# EAGLE design TrSensorModule (EAGLE 5.11)
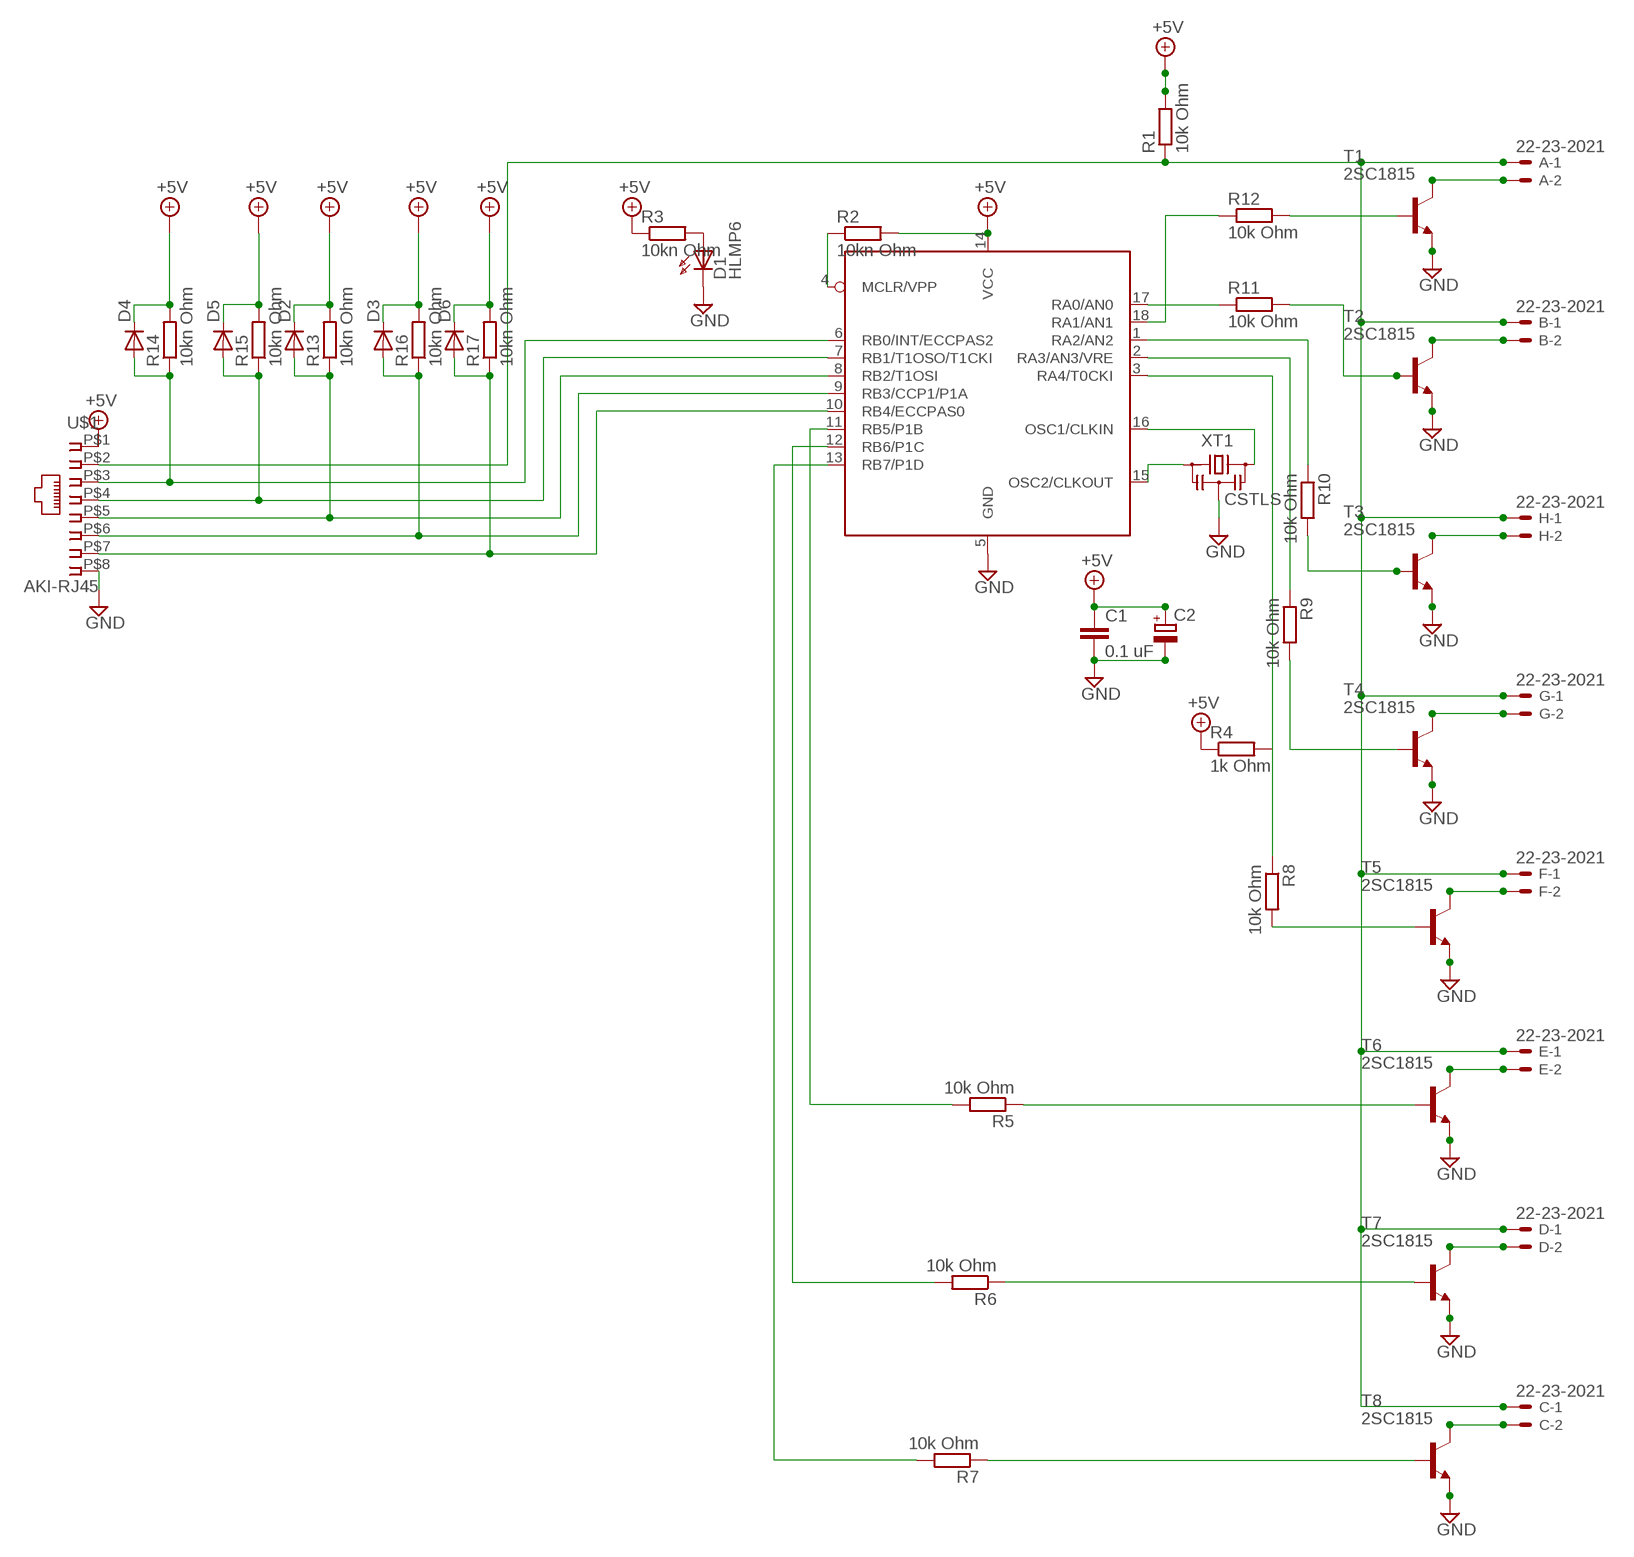
[diagram p0: schematic, sheet 1]

## Parts
A  22-23-2021  [22-23-2021]
B  22-23-2021  [22-23-2021]
C  22-23-2021  [22-23-2021]
C1  0.1 uF  C2.5/2  [C2.5-2]
C2  CPOL-EUE2.5-6  [E2,5-6]
D  22-23-2021  [22-23-2021]
D1  HLMP6  [HLMP6]
D2  DIODE-D-2.5  [D-2.5]
D3  DIODE-D-2.5  [D-2.5]
D4  DIODE-D-2.5  [D-2.5]
D5  DIODE-D-2.5  [D-2.5]
D6  DIODE-D-2.5  [D-2.5]
E  22-23-2021  [22-23-2021]
F  22-23-2021  [22-23-2021]
G  22-23-2021  [22-23-2021]
H  22-23-2021  [22-23-2021]
IC1  PIC16F716-P  [DIL18]
R1  10k Ohm  R-EU_0204/2V  [0204V]
R2  10kn Ohm  R-EU_0204/2V  [0204V]
R3  10kn Ohm  R-EU_0204/7  [0204/7]
R4  1k Ohm  R-EU_0207/2V  [0207/2V]
R5  10k Ohm  R-EU_0204/2V  [0204V]
R6  10k Ohm  R-EU_0204/2V  [0204V]
R7  10k Ohm  R-EU_0204/2V  [0204V]
R8  10k Ohm  R-EU_0204/2V  [0204V]
R9  10k Ohm  R-EU_0204/2V  [0204V]
R10  10k Ohm  R-EU_0204/2V  [0204V]
R11  10k Ohm  R-EU_0204/2V  [0204V]
R12  10k Ohm  R-EU_0204/2V  [0204V]
R13  10kn Ohm  R-EU_0204/2V  [0204V]
R14  10kn Ohm  R-EU_0204/2V  [0204V]
R15  10kn Ohm  R-EU_0204/2V  [0204V]
R16  10kn Ohm  R-EU_0204/2V  [0204V]
R17  10kn Ohm  R-EU_0204/2V  [0204V]
T1  2SC1815  [TO92-ECB]
T2  2SC1815  [TO92-ECB]
T3  2SC1815  [TO92-ECB]
T4  2SC1815  [TO92-ECB]
T5  2SC1815  [TO92-ECB]
T6  2SC1815  [TO92-ECB]
T7  2SC1815  [TO92-ECB]
T8  2SC1815  [TO92-ECB]
U$1  AKI-RJ45  [C-00159]
XT1  CSTLS  [S3P]

## Nets
+5V: C1.1 C2.+ D2.C D3.C D4.C D5.C D6.C IC1.14(VCC) R1.2 R2.2 R3.1 R4.1 R13.2 R14.2 R15.2 R16.2 R17.2 U$1.P$1
GND: C1.2 C2.- D1.K IC1.5(GND) T1.E T2.E T3.E T4.E T5.E T6.E T7.E T8.E U$1.P$8 XT1.P$2
N$1: D4.A IC1.6(RB0/INT/ECCPAS2) R14.1 U$1.P$3
N$2: D5.A IC1.7(RB1/T1OSO/T1CKI) R15.1 U$1.P$4
N$3: D2.A IC1.8(RB2/T1OSI) R13.1 U$1.P$5
N$4: D3.A IC1.9(RB3/CCP1/P1A) R16.1 U$1.P$6
N$5: IC1.15(OSC2/CLKOUT) XT1.P$1
N$6: A.1 B.1 C.1 D.1 E.1 F.1 G.1 H.1 R1.1 U$1.P$2
N$7: A.2 T1.C
N$8: R11.2 T2.B
N$9: IC1.16(OSC1/CLKIN) XT1.P$3
N$10: IC1.1(RA2/AN2) R10.1
N$11: H.2 T3.C
N$12: B.2 T2.C
N$13: IC1.2(RA3/AN3/VRE) R9.1
N$14: G.2 T4.C
N$15: E.2 T6.C
N$16: F.2 T5.C
N$17: IC1.3(RA4/T0CKI) R4.2 R8.1
N$18: IC1.11(RB5/P1B) R5.2
N$19: C.2 T8.C
N$20: D.2 T7.C
N$21: IC1.12(RB6/P1C) R6.2
N$22: IC1.13(RB7/P1D) R7.2
N$23: IC1.4(MCLR/VPP) R2.1
N$24: D6.A IC1.10(RB4/ECCPAS0) R17.1 U$1.P$7
N$25: IC1.18(RA1/AN1) R12.1
N$26: D1.A R3.2
N$27: R5.1 T6.B
N$28: R6.1 T7.B
N$29: R7.1 T8.B
N$30: R8.2 T5.B
N$31: R9.2 T4.B
N$32: R10.2 T3.B
N$33: IC1.17(RA0/AN0) R11.1
N$34: R12.2 T1.B

## Library data of the parts
A B C D E F G H = con-molex:22-23-2021: .100" (2.54mm) Center Header - 2 Pin; MF: MOLEX; MPN: 22-23-2021; OC_FARNELL: 1462926; OC_NEWARK: 25C3832
C1 = capacitor-wima:C: CAPACITOR naming: grid - package width
C2 = rcl:CPOL-EU: POLARIZED CAPACITOR, European symbol
D1 = display-hp:HLMP6: LED 2mm horizontal; MF: AGILENT TECHNOLOGIES; MPN: HLMP-6500; OC_FARNELL: 1652490; OC_NEWARK: 40K0088
D2-D6 = diode:DIODE-: DIODE
IC1 = microchip_pic16f716:PIC16F716-P: PIC16F716 in DIL18 package
R1-R3 R5-R17 = rcl:R-EU_: RESISTOR, European symbol
R4 = resistor:R-EU_: RESISTOR, European symbol
T1-T8 = myparts:2SC1815: NPN EPITAXIAL TRANSISTOR Source: TOSHIBA .. 2SC1815 1.pdf
U$1 = myparts:AKI-RJ45
XT1 = TOG:CSTLS: Resonator, Murata Ceralock

## Board
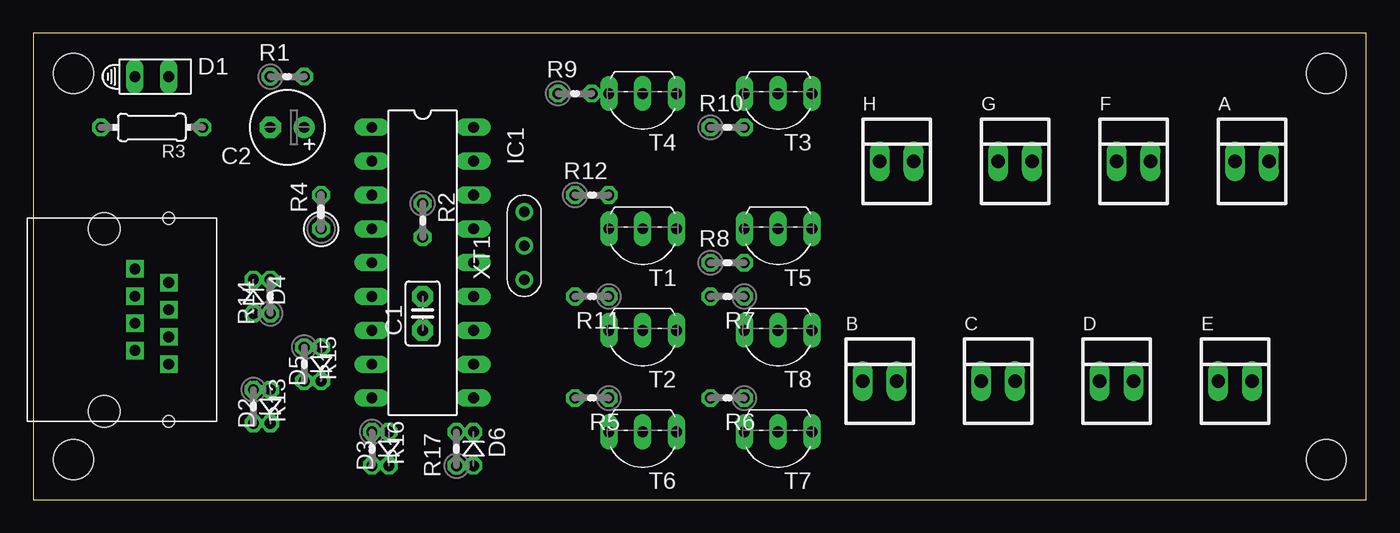
[diagram p1: board, top side]
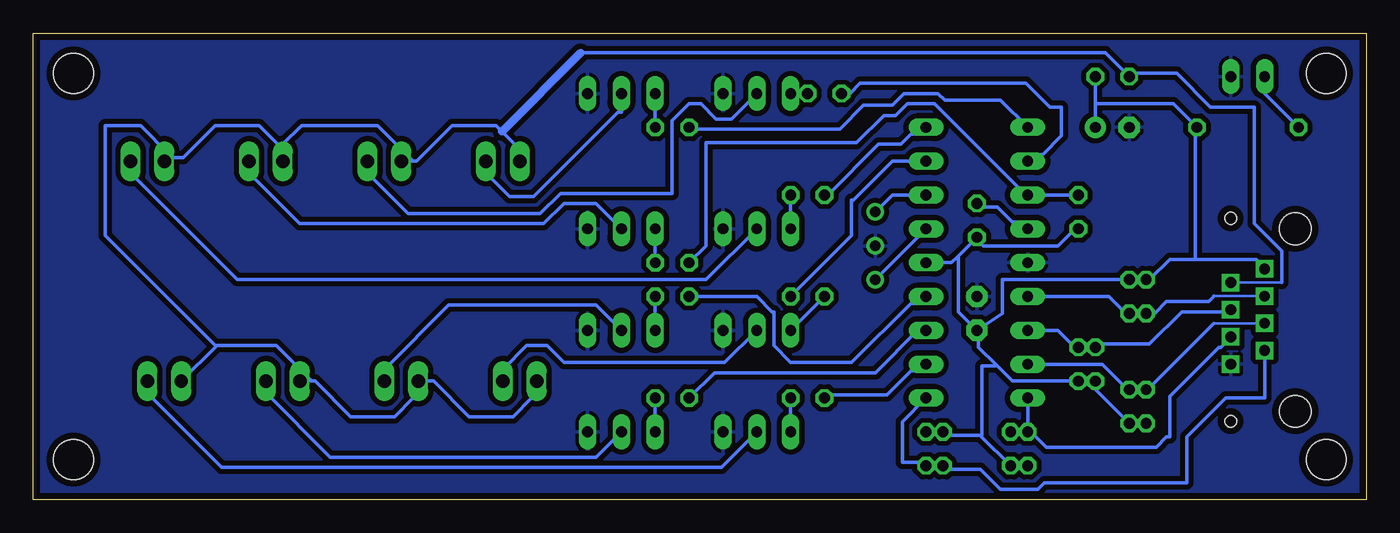
[diagram p2: board, bottom side, seen from below]

Size 100 x 35 mm. Coordinates in mm from the lower left corner, seen from the top.
Outline: 0,0 100,0 100,35 0,35 0,0
Copper layers (1*16): Top 0.035mm / dielectric 1.5mm / Bottom 0.035mm
Design rules "default *": minimum track width 10mil, minimum drill 15mil, track to track 15mil, track to pad 17mil, pad to pad 20mil, via to via 16mil, smd to smd 16mil, copper to edge 20mil, drill to drill 16mil, minimum pad ring 10mil, minimum via ring 8mil, stop-mask expansion 4mil, vias tented up to drill 0mil, thermal gap 10mil
Holes 3 mm at 3,3 3,32 97,32 97,3

### Footprints (pad centres in the part's own frame; a part is rotated, then mirrored left to right if it is on the bottom)
22-23-2021 = drill 1 long: 1 -1.27,0; 2 1.27,0
C2.5-2 = drill 0.813 pad 1.6 octagon: 1 -1.27,0; 2 1.27,0
E2,5-6 = drill 0.813 pad 1.6 round: + -1.27,0 | drill 0.813 pad 1.6 octagon: - 1.27,0
HLMP6 = drill 0.813 long: A -1.27,0; K 1.27,0
D-2.5 = drill 0.813 octagon: A 1.27,0; C -1.27,0
DIL18 = drill 0.813 long: 1 0,0; 2 2.54,0; 3 5.08,0; 4 7.62,0; 5 10.16,0; 6 12.7,0; 7 15.24,0; 8 17.78,0; 9 20.32,0; 10 20.32,7.62; 11 17.78,7.62; 12 15.24,7.62; 13 12.7,7.62; 14 10.16,7.62; 15 7.62,7.62; 16 5.08,7.62; 17 2.54,7.62; 18 0,7.62
0204V = drill 0.813 octagon: 1 -1.27,0; 2 1.27,0
0204/7 = drill 0.813 octagon: 1 -3.81,0; 2 3.81,0
0207/2V = drill 0.813 octagon: 1 -1.27,0; 2 1.27,0
TO92-ECB = drill 0.813 long: B 2.54,0; C 0,0; E -2.54,0
C-00159 = drill 0.8 square: P$1 0,0.8; P$2 2.54,-0.22; P$3 0,-1.24; P$4 2.54,-2.26; P$5 0,-3.28; P$6 2.54,-4.3; P$7 0,-5.32; P$8 2.54,-6.34 | hole 2.4: -2.3,-9.885; -2.3,3.805 | hole 0.9: 2.54,4.605; 2.54,-10.635
S3P = drill 0.8 round: P$1 -2.54,0; P$2 0,0; P$3 2.54,0

### Placement (x,y rotation side)
A  91.44,25.4 0 top
B  63.5,8.89 0 top
C  72.39,8.89 0 top
C1  29.21,13.97 90 top
C2  19.05,27.94 180 top
D  81.28,8.89 0 top
D1  8.89,31.75 0 top
D2  17.78,6.99 90 top
D3  26.67,3.81 90 top
D4  16.51,15.24 270 top
D5  21.59,10.16 90 top
D6  33.02,3.81 270 top
E  90.17,8.89 0 top
F  82.55,25.4 0 top
G  73.66,25.4 0 top
H  64.77,25.4 0 top
IC1  25.4,27.94 270 top
R1  19.05,31.75 0 top
R2  29.21,20.95 270 top
R3  8.89,27.94 180 top
R4  21.59,21.59 90 top
R5  41.91,7.62 180 top
R6  52.07,7.62 180 top
R7  52.07,15.24 180 top
R8  52.07,17.78 0 top
R9  40.64,30.48 0 top
R10  52.07,27.94 0 top
R11  41.91,15.24 180 top
R12  41.91,22.86 0 top
R13  16.51,6.99 270 top
R14  17.78,15.24 90 top
R15  20.32,10.16 270 top
R16  25.4,3.81 270 top
R17  31.75,3.81 90 top
T1  45.72,20.32 180 top
T2  45.72,12.7 180 top
T3  55.88,30.48 180 top
T4  45.72,30.48 180 top
T5  55.88,20.32 180 top
T6  45.72,5.08 180 top
T7  55.88,5.08 180 top
T8  55.88,12.7 180 top
U$1  7.62,16.51 0 top
XT1  36.83,19.05 90 top

### Tracks (layer width: path | path; a pad name or v marks a point on that pad's centre or on a via)
+5V
  Bottom 0.254: 30.67,18.22 31.11,17.78 IC1.14 | 30.67,18.22 R2.2 29.21,19.56 28.7,19.05 23.11,19.05 22.1,20.07 21.84,20.07 R4.1 21.59,20.19 21.46,20.19 | C1.1 30.61,14.1 30.61,18.16 30.67,18.22 | 20.95,8.89 R15.2 | R13.2 D2.C 20.95,8.89 | 28.89,4.76 28.96,4.83 31.11,4.83 31.37,5.08 R17.2 D6.C | 27.75,10.1 29.08,11.43 29.08,12.7 C1.1 | 27.75,10.1 26.54,8.89 D5.C 20.95,8.89 | 28.89,4.76 28.83,4.83 28.83,10.03 27.81,10.03 27.75,10.1 | R16.2 D3.C 28.89,4.76 | 20.32,29.72 C2.+ | 20.32,29.72 R1.2 | C1.1 27.3,13.97 27.3,16.51 R14.2 D4.C 16.26,16.51 14.73,18.03 12.83,18.03 | 12.83,18.03 8.26,18.03 7.62,17.4 U$1.P$1 | 20.32,29.72 14.48,29.72 R3.1 12.83,27.94 12.83,18.03
GND
  pour Bottom: 0,35.56 0,0 101.6,0 101.6,35.56
N$1
  Bottom 0.2: U$1.P$3 11.43,15.27
  Bottom 0.254: IC1.6 19.3,15.24 18.03,13.97 R14.1 D4.A 15.88,13.97 14.99,14.86 11.81,14.86 11.43,15.24 11.43,15.27
N$2
  Bottom 0.254: IC1.7 23.11,12.7 21.84,11.43 D5.A R15.1 19.94,11.43 19.68,11.68 16.26,11.68 13.84,14.1 10.29,14.1 10.16,14.22 U$1.P$4
N$3
  Bottom 0.2: U$1.P$5 11.43,13.23
  Bottom 0.254: IC1.8 19.81,10.16 17.91,8.26 D2.A R13.1 16.38,8.26 11.43,13.21 11.43,13.23
N$4
  Bottom 0.254: R16.1 D3.A | R16.1 IC1.9 | R16.1 25.15,5.08 24,3.94 15.75,3.94 14.99,4.7 14.73,4.7 14.73,7.75 11.05,11.43 10.92,11.43 10.16,12.19 U$1.P$6
N$5
  Bottom 0.254: XT1.P$1 IC1.15
N$6
  Bottom 0.2: 6.35,16.29 U$1.P$2
  Bottom 0.254: B.1 62.23,7.62 62.61,7.62 64.01,6.22 67.31,6.22 69.98,8.89 C.1 71.12,7.62 71.5,7.62 72.9,6.22 76.2,6.22 78.87,8.89 79.12,8.89 | 79.12,8.89 D.1 | 86.3,11.49 86.23,11.56 81.79,11.56 79.12,8.89 | 86.3,11.49 E.1 | 86.3,11.49 94.61,19.81 94.61,28.07 91.95,28.07 89.79,25.91 A.1 89.92,25.65 88.77,25.65 86.36,28.07 83.06,28.07 81.66,26.67 81.28,26.67 | H.1 63.5,26.67 63.88,26.67 64.83,27.62 65.28,28.07 68.58,28.07 71.25,25.4 71.5,25.4 | 71.5,25.4 G.1 | 81.28,26.67 79.88,28.07 74.17,28.07 71.5,25.4 | 81.28,26.67 F.1 | 58.93,33.53 19.56,33.53 R1.1 17.91,32 14.22,32 11.68,29.46 8.38,29.46 8.38,20.7 6.35,18.67 6.35,16.29
  Bottom 0.61: 58.93,33.53 64.83,27.62
N$7
  Bottom 0.254: T1.C 49.53,16.51 84.71,16.51 92.71,24.51 A.2
N$8
  Bottom 0.254: R11.2 T2.B
N$9
  Bottom 0.254: XT1.P$3 35.56,22.86 IC1.16
N$10
  Bottom 0.254: IC1.1 27.43,29.97 31.62,29.97 32.13,30.48 34.67,30.48 35.56,29.59 37.72,29.59 39.5,27.81 50.67,27.81 R10.1
N$11
  Bottom 0.254: T3.C 55.88,29.08 56.13,29.08 62.48,22.73 64.26,22.73 66.04,24.51 H.2
N$12
  Bottom 0.254: T2.C 48.13,10.29 60.2,10.29 61.47,11.56 62.99,11.56 64.77,9.78 B.2
N$13
  Bottom 0.254: IC1.2 24.89,25.91 24.26,25.91 22.86,27.3 22.86,29.46 23.75,29.46 25.53,31.24 37.97,31.24 38.73,30.48 R9.1
N$14
  Bottom 0.254: T4.C 47.62,28.57 48.77,28.57 49.91,29.72 50.8,29.72 52.07,28.45 52.07,22.99 60.45,22.99 61.98,21.46 71.88,21.46 74.93,24.51 G.2
N$15
  Bottom 0.254: T6.C 48.39,2.41 85.85,2.41 91.44,8 E.2
N$16
  Bottom 0.254: T5.C 57.78,22.23 60.2,22.23 61.72,20.7 80.01,20.7 83.82,24.51 F.2
N$17
  Bottom 0.254: R4.2 IC1.3 25.53,22.86 32.38,29.72 34.42,29.72 35.31,28.83 36.2,28.83 38.23,26.8 49.53,26.8 49.53,19.05 R8.1
N$18
  Bottom 0.254: IC1.11 33.53,9.65 34.16,9.65 35.94,7.87 40.01,7.87 40.26,7.62 R5.2
N$19
  Bottom 0.254: T8.C 57.78,14.61 68.83,14.61 73.66,9.78 C.2
N$20
  Bottom 0.254: T7.C 57.78,3.17 77.72,3.17 82.55,8 D.2
N$21
  Bottom 0.254: R6.2 48.9,9.53 36.83,9.53 33.66,12.7 IC1.12
N$22
  Bottom 0.254: IC1.13 33.53,14.73 34.16,14.73 38.61,10.29 43.18,10.29 44.45,11.56 44.45,14.1 44.58,14.1 45.72,15.24 R7.2
N$23
  Bottom 0.254: IC1.4 25.91,20.83 26.54,20.83 27.69,21.97 28.57,21.97 28.83,22.23 R2.1
N$24
  Bottom 0.254: IC1.10 34.8,5.84 34.8,2.79 33.66,2.79 33.4,2.54 D6.A R17.1 31.37,2.54 31.11,2.29 28.96,2.29 27.43,0.76 24.64,0.76 24.13,1.27 13.46,1.27 13.46,4.7 10.54,7.62 7.62,7.62 U$1.P$7
N$25
  Bottom 0.254: IC1.18 33.53,27.43 34.16,27.43 34.92,26.67 36.58,26.67 40.39,22.86 R12.1
N$26
  Bottom 0.254: R3.2 7.62,30.48 D1.A
N$27
  Bottom 0.254: T6.B R5.1
N$28
  Bottom 0.254: T7.B R6.1
N$29
  Bottom 0.254: T8.B R7.1
N$30
  Bottom 0.254: R8.2 T5.B
N$31
  Bottom 0.254: R9.2 T4.B
N$32
  Bottom 0.254: R10.2 T3.B
N$33
  Bottom 0.254: R11.1 38.61,19.81 38.61,22.48 38.48,22.48 35.56,25.4 IC1.17
N$34
  Bottom 0.254: T1.B R12.2